# EAGLE schematic radiojove (EAGLE 9.3.0)
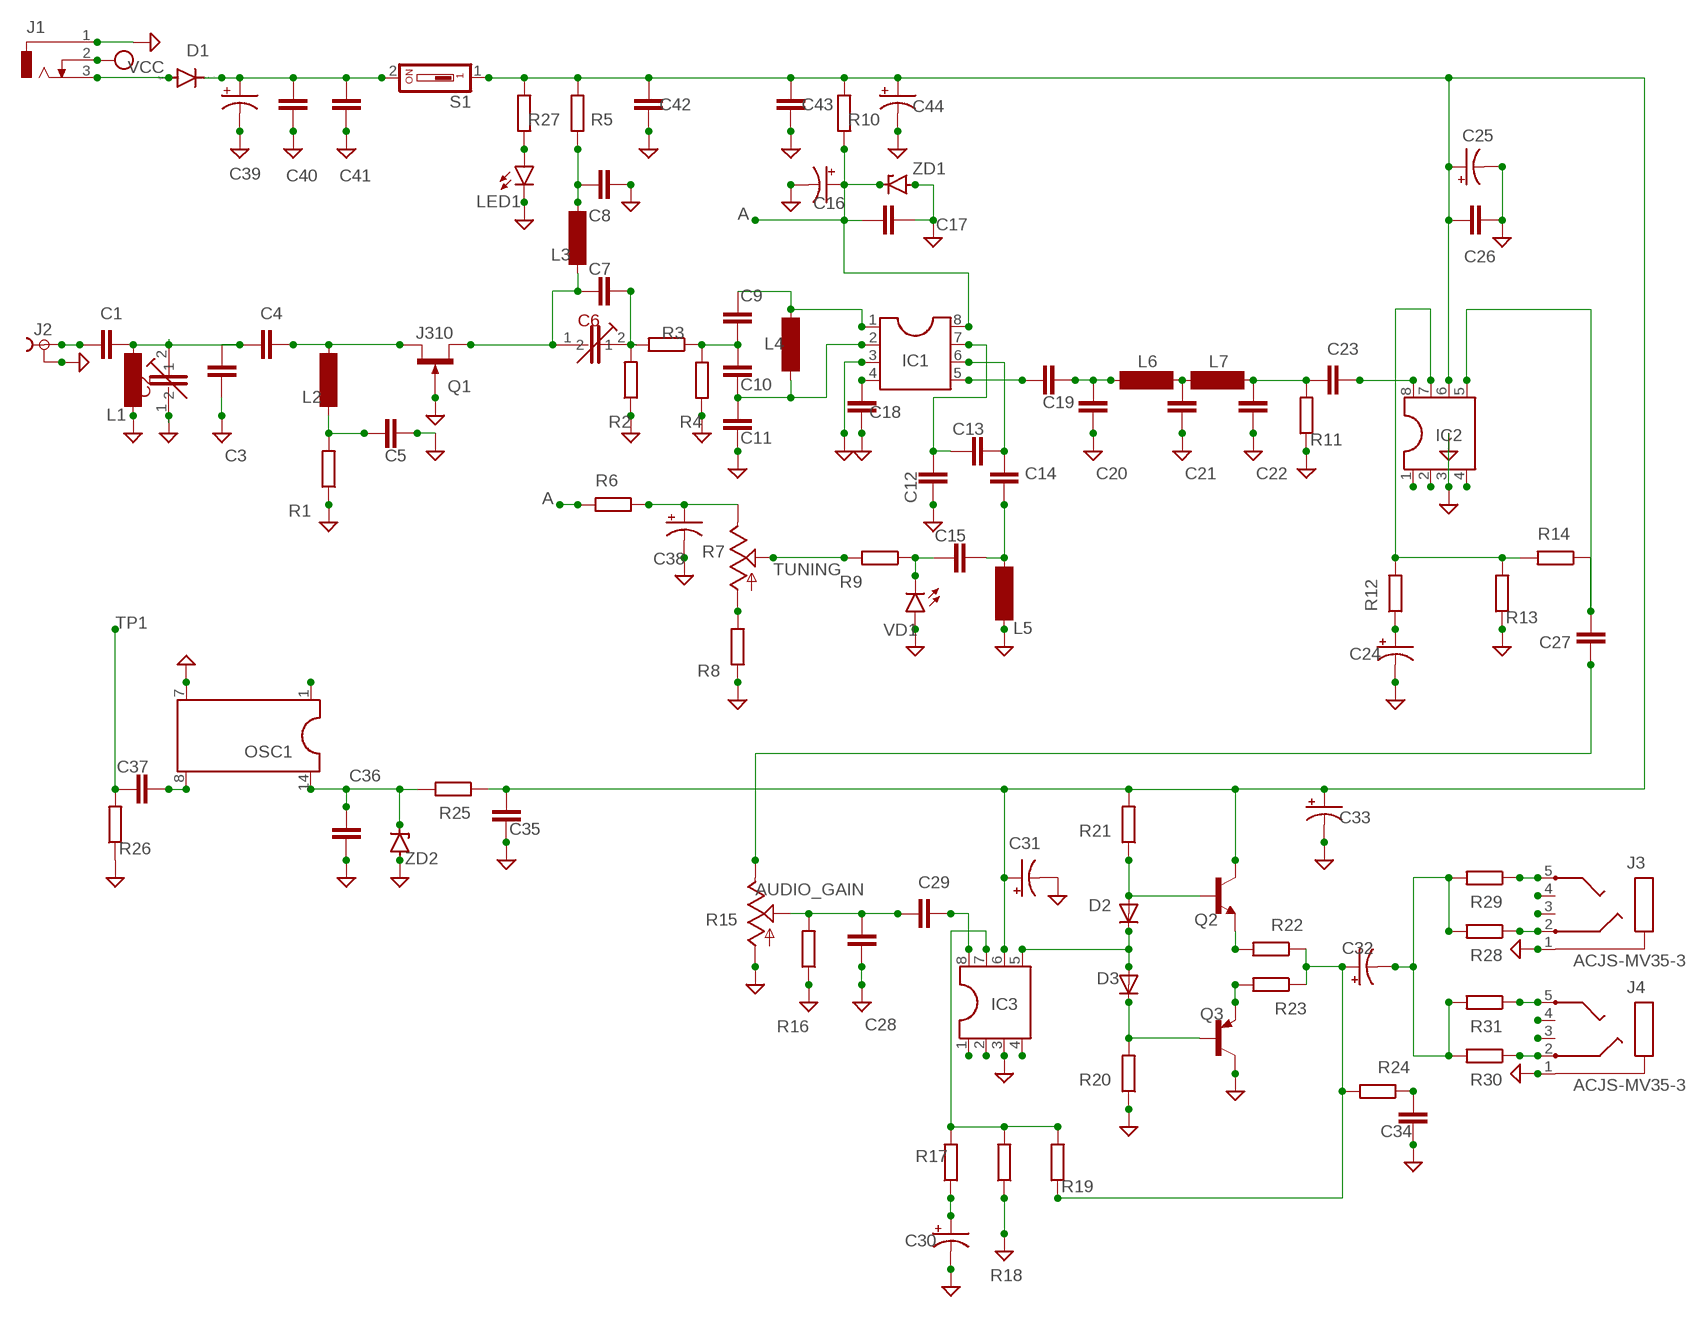
[diagram p0: schematic, sheet 1]

## Parts
C1  C2,5-3  [C2.5-3]
C2  GYC20000  [10_MM_TOP_BOTTOM_3_LEAD_STD]
C3  C2,5-3  [C2.5-3]
C4  C2,5-3  [C2.5-3]
C5  C2,5-3  [C2.5-3]
C6  GYC20000  [10_MM_TOP_BOTTOM_3_LEAD_STD]
C7  C2,5-3  [C2.5-3]
C8  C2,5-3  [C2.5-3]
C9  C2,5-3  [C2.5-3]
C10  C2,5-3  [C2.5-3]
C11  C2,5-3  [C2.5-3]
C12  C2,5-3  [C2.5-3]
C13  C2,5-3  [C2.5-3]
C14  C2,5-3  [C2.5-3]
C15  C2,5-3  [C2.5-3]
C16  CPOL-USB45181A  [B45181A]
C17  C2,5-3  [C2.5-3]
C18  C2,5-3  [C2.5-3]
C19  C2,5-3  [C2.5-3]
C20  C2,5-3  [C2.5-3]
C21  C2,5-3  [C2.5-3]
C22  C2,5-3  [C2.5-3]
C23  C2,5-3  [C2.5-3]
C24  CPOL-USB45181A  [B45181A]
C25  CPOL-USB45181A  [B45181A]
C26  C2,5-3  [C2.5-3]
C27  C2,5-3  [C2.5-3]
C28  C2,5-3  [C2.5-3]
C29  C2,5-3  [C2.5-3]
C30  CPOL-USB45181A  [B45181A]
C31  CPOL-USB45181A  [B45181A]
C32  CPOL-USB45181A  [B45181A]
C33  CPOL-USB45181A  [B45181A]
C34  C2,5-3  [C2.5-3]
C35  C2,5-3  [C2.5-3]
C36  C2,5-3  [C2.5-3]
C37  C2,5-3  [C2.5-3]
C38  CPOL-USB45181A  [B45181A]
C39  CPOL-USB45181A  [B45181A]
C40  C2,5-3  [C2.5-3]
C41  C2,5-3  [C2.5-3]
C42  C2,5-3  [C2.5-3]
C43  C2,5-3  [C2.5-3]
C44  CPOL-USB45181A  [B45181A]
D1  1N4004  [DO41-10]
D2  1N4004  [DO41-10]
D3  1N4004  [DO41-10]
IC1  DIL8S  [SOCKET-08]
IC2  DIL8  [DIL08]
IC3  DIL8  [DIL08]
J1  DCJ0202  [DCJ0202]
J2  KOBU1H  [KOBU1H]
J3  ACJS-MV35-3  [ACJS-MV35-3]
J4  ACJS-MV35-3  [ACJS-MV35-3]
L1  SD12-1000  [SD12_1000]
L2  SD12-1000  [SD12_1000]
L3  SD12-1000  [SD12_1000]
L4  SD12-1000  [SD12_1000]
L5  SD12-1000  [SD12_1000]
L6  SD12-1000  [SD12_1000]
L7  SD12-1000  [SD12_1000]
LED1  LED3MM  [LED3MM]
OSC1  DIL14/4  [DIL14/4]
Q1  J310  [TO92R]
Q2  2N3904  [TO92]
Q3  2N3906  [TO92]
R1  R  (no package)
R2  R  (no package)
R3  R  (no package)
R4  R  (no package)
R5  R  (no package)
R6  R  (no package)
R7  TRIM_US-3223G  [3223G]
R8  R  (no package)
R9  R  (no package)
R10  R  (no package)
R11  R  (no package)
R12  R  (no package)
R13  R  (no package)
R14  R  (no package)
R15  TRIM_US-3223G  [3223G]
R16  R  (no package)
R17  R  (no package)
R18  R  (no package)
R19  R  (no package)
R20  R  (no package)
R21  R  (no package)
R22  R  (no package)
R23  R  (no package)
R24  R  (no package)
R25  R  (no package)
R26  R  (no package)
R27  R  (no package)
R28  R  (no package)
R29  R  (no package)
R30  R  (no package)
R31  R  (no package)
S1  SD4-01  [SD4-01]
VD1  PL006-WCR12  [SOT23]
ZD1  1N4728  [DO41Z10]
ZD2  1N4728  [DO41Z10]

## Nets
A: C16.+ C17.2 IC1.8 R6.2 R10.1 ZD1.C
AUDIO_GAIN: C28.2 C29.2 R15.2(S) R16.2
GND: C2.1 C3.1 C5.1 C8.2 C11.1 C12.1 C16.- C17.1 C18.1 C20.1 C21.1 C22.1 C24.- C25.- C26.2 C28.1 C30.- C31.- C33.- C34.1 C35.1 C36.1 C38.- C39.- C40.2 C41.2 C42.2 C43.2 C44.- IC1.3 IC2.3 IC3.3 J1.1 J2.2 J2.2@1 J3.1 J4.1 L1.2 L5.2 LED1.K(C) OSC1.7 Q1.G Q3.1(C) R1.1 R2.1 R4.2 R8.1 R11.1 R13.1 R15.1(A) R16.1 R18.1 R20.1 R26.1 VD1.1(A) ZD1.A ZD2.A
N$1: D1.A J1.3
N$2: C29.1 IC3.8
N$3: C39.+ C40.1 C41.1 D1.C S1.2
N$4: LED1.A R27.1
N$5: C8.1 L3.1 R5.1
N$6: C9.2 IC1.1 L4.1
N$7: C6.1 C7.1 L3.2 Q1.S
N$8: C6.2 C7.2 R2.2 R3.2
N$9: C4.1 L2.1 Q1.D
N$10: J4.3
N$11: J3.5 R29.1
N$12: J4.5 R31.1
N$13: C1.2 J2.1
N$14: C1.1 C2.2 C3.2 C4.2 L1.1
N$15: C5.2 L2.2 R1.2
N$16: C9.1 C10.2 R3.1 R4.1
N$17: C10.1 C11.2 IC1.2 L4.2
N$18: C18.2 IC1.4
N$19: C19.2 IC1.5
N$20: C12.2 C13.1 IC1.7
N$21: C15.2 R9.1 VD1.3(C)
N$22: C19.1 C20.2 L6.1
N$23: C21.2 L6.2 L7.1
N$24: C22.2 C23.2 L7.2 R11.2
N$25: C13.2 C14.2 IC1.6
N$26: C23.1 IC2.8
N$27: C38.+ R6.1 R7.3(E)
N$28: R7.1(A) R8.2
N$29: C24.+ R12.1
N$30: C27.2 IC2.5 R14.1
N$31: IC2.7 R12.2 R13.2 R14.2
N$32: C27.1 R15.3(E)
N$33: IC2.1
N$34: IC2.2
N$35: IC2.4
N$36: J4.2 R30.1
N$37: J3.2 R28.1
N$38: C32.- R28.2 R29.2 R30.2 R31.2
N$39: C32.+ R19.1 R22.1 R23.1 R24.2
N$40: C34.2 R24.1
N$41: Q2.3(E) R22.2
N$42: Q3.3(E) R23.2
N$43: D2.C D3.A IC3.5
N$44: D2.A Q2.2(B) R21.1
N$45: D3.C Q3.2(B) R20.2
N$46: C25.+ C26.1 C31.+ C33.+ C35.2 C42.1 C43.1 C44.+ IC2.6 IC3.6 Q2.1(C) R5.2 R10.2 R21.2 R25.1 R27.2 S1.1
N$47: C30.+ R17.1
N$48: IC3.7 R17.2 R18.2 R19.2
N$49: IC3.1
N$50: IC3.2
N$51: IC3.4
N$52: C14.1 C15.1 L5.1
N$53: C36.2 OSC1.14 R25.2 ZD2.C
N$54: OSC1.1
N$55: C37.1 OSC1.8
N$56: J4.4
N$57: J3.3
N$58: J3.4
TP1: C37.2 R26.2
TUNING: R7.2(S) R9.2
VCC: J1.2

## Library data of the parts
C1 C3-C5 C7-C15 C17-C23 C26-C29 C34-C37 C40-C43 = capacitor-wima:C: CAPACITOR naming: grid - package width
C2 C6 = sprague-goodman:GYC20000
C16 C24 C25 C30-C33 C38 C39 C44 = rcl:CPOL-US: POLARIZED CAPACITOR, American symbol; SPICEPREFIX: C
D1 = diode:1N4004: DIODE
D2 D3 = adafruit:1N4004: DIODE
IC1-IC3 = ic-package:DIL8: Dual In Line / Socket
J1 = con-jack:DCJ0202: DC POWER JACK Source: DCJ0202.pdf; OC_FARNELL: unknown; OC_NEWARK: unknown
J2 = con-hirschmann:KOBU1H: Female RF CONNECTOR horizontal; OC_FARNELL: unknown; OC_NEWARK: unknown
J3 J4 = bw-custom:ACJS-MV35-3: MIC/HEADPHONE JACK KS-S stereo microphone/headphone jack PG203JN (Schukat); OC_FARNELL: unknown; OC_NEWARK: unknown
L1-L7 = inductor-neosid:SD12: INDUCTOR nominal inductance; OC_FARNELL: unknown; OC_NEWARK: unknown
LED1 = led:LED: LED OSRAM: - CHIPLED LG R971, LG N971, LY N971, LG Q971, LY Q971, LO R971, LY R971 LH N974, LH R974 LS Q976, LO Q976, LY Q976 LO Q996 - Hyper CHIPLED LW Q18S LB Q993, LB Q99A, LB R99A - SideLED LS A670, LO A670, LY A670, LG A670, LP A670 LB A673, LV A673, LT A673, LW A673 LH A674 LY A675 LS A676, LA A676, LO A676, LY A676, LW A676 LS A679, LY A679, LG A679 - Hyper Micro SIDELED® LS Y876, LA Y876, LO Y876, LY Y876 LT Y87S - SmartLED LW L88C, LW L88S LB L89C, LB L89S, LG L890 LS L89K, LO L89K, LY L89K LS L896, LA L896, LO L896, LY L896 - TOPLED LS T670, LO T670, LY T670, LG T670, LP T670 LSG T670, LSP T670, LSY T670, LOP T670, LYG T670 LG T671, LOG T671, LSG T671 LB T673, LV T673, LT T673, LW T673 LH T674 LS T676, LA T676, LO T676, LY T676, LB T676, LH T676, LSB T676, LW T676 LB T67C, LV T67C, LT T67C, LS T67K, LO T67K, LY T67K, LW E67C LS E67B, LA E67B, LO E67B, LY E67B, LB E67C, LV E67C, LT E67C LW T67C LS T679, LY T679, LG T679 LS T770, LO T770, LY T770, LG T770, LP T770 LB T773, LV T773, LT T773, LW T773 LH T774 LS E675, LA E675, LY E675, LS T675 LS T776, LA T776, LO T776, LY T776, LB T776 LHGB T686 LT T68C, LB T68C - Hyper Mini TOPLED® LB M676 - Mini TOPLED Santana® LG M470 LS M47K, LO M47K, LY M47K Source: http://www.osram.convergy.de LUXEON: - LUMILED® LXK2-PW12-R00, LXK2-PW12-S00, LXK2-PW14-U00, LXK2-PW14-V00 LXK2-PM12-R00, LXK2-PM12-S00, LXK2-PM14-U00 LXK2-PE12-Q00, LXK2-PE12-R00, LXK2-PE12-S00, LXK2-PE14-T00, LXK2-PE14-U00 LXK2-PB12-K00, LXK2-PB12-L00, LXK2-PB12-M00, LXK2-PB14-N00, LXK2-PB14-P00, LXK2-PB14-Q00 LXK2-PR12-L00, LXK2-PR12-M00, LXK2-PR14-Q00, LXK2-PR14-R00 LXK2-PD12-Q00, LXK2-PD12-R00, LXK2-PD12-S00 LXK2-PH12-R00, LXK2-PH12-S00 LXK2-PL12-P00, LXK2-PL12-Q00, LXK2-PL12-R00 Source: www.luxeon.com KINGBRIGHT: KA-3528ASYC Source: www.kingbright.com
OSC1 = ic-package:DIL14/4: Dual In Line / Socket
Q1 = transistor-small-signal:J310: N-Channel RF Amplifier J309, J310 Source: http://www.fairchildsemi.com/pf/J3/J310.html
Q2 = transistor:2N3904: NPN TRANSISTOR
Q3 = transistor-pnp:2N3906: PNP Transistor
R1-R6 R8-R14 R16-R31 = ngspice-simulation:R: RESISTOR
R7 R15 = pot:TRIM_US-: POTENTIOMETER
S1 = switch-dil:SD4-01: DIL/CODE SWITCH; OC_FARNELL: unknown; OC_NEWARK: unknown
VD1 = led:PL006*: PLH006 Series SMD LED SOT23 PLH006-WCR21 Super Red PLH006-WCR12 High Eff Red PLH006-WCG13 Green PLH006-WCY01 Yellow www.p-tec.net Source: http://www.wittig-electronic.de/PTEC/PL006Series.pdf
ZD1 ZD2 = diode:1N4728: Z DIODE 3.3 V, 1W, 5 percent

## Module SA602A
Ports: 

### Library data of the parts